# EAGLE design alswitch (EAGLE 7.5.0)
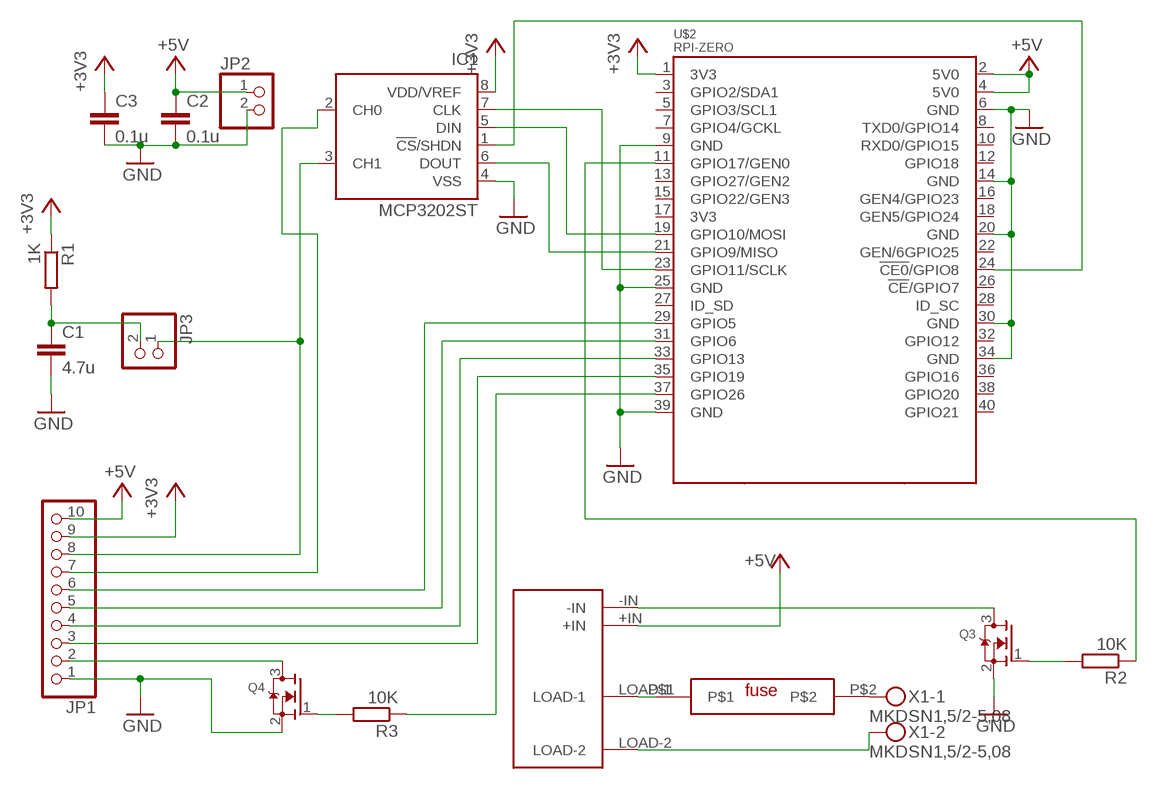
[diagram p0: schematic, sheet 1]

## Parts
C1  4.7u  C-EUC1206  [C1206]
C2  0.1u  C-EUC1206  [C1206]
C3  0.1u  C-EUC1206  [C1206]
IC1  MCP3202ST  [TSSOP8]
JP1  PINHD-1X10  [1X10]
JP2  PINHD-1X2  [1X02]
JP3  PINHD-1X2  [1X02]
Q3  MOSFET-NREFLOW  [SOT23]
Q4  MOSFET-NREFLOW  [SOT23]
R1  1K  R-EU_R0805  [R0805]
R2  10K  R-EU_R0805  [R0805]
R3  10K  R-EU_R0805  [R0805]
U$1  FUSE  [FUSE]
U$2  RPI-ZERO  [RASPBERRYPI_BASTELSTUBE_V13_RASPI_BOARD_B+_FULL]
U$3  G3MC-201PL  [G3MC-201PL]
X1  MKDSN1,5/2-5,08  [MKDSN1,5/2-5,08]

## Nets
+3V3: C3.1 IC1.8(VDD/VREF) JP1.9 R1.1 U$2.1(3V3)
+5V: C2.1 JP1.10 JP2.1 U$2.2(5V0) U$2.4(5V0) U$3.+IN
GND: C1.2 C2.2 C3.2 IC1.4(VSS) JP1.1 JP2.2 Q3.2(S) Q4.2(S) U$2.6(GND) U$2.9(GND) U$2.14(GND) U$2.20(GND) U$2.25(GND) U$2.30(GND) U$2.34(GND) U$2.39(GND)
N$1: IC1.7(CLK) U$2.23(GPIO11/SCLK)
N$2: Q3.3(D) U$3.-IN
N$3: R2.1 U$2.11(GPIO17/GEN0)
N$4: U$1.P$2 X1.1
N$5: IC1.5(DIN) U$2.19(GPIO10/MOSI)
N$6: IC1.6(DOUT) U$2.21(GPIO9/MISO)
N$7: Q3.1(G) R2.2
N$8: JP1.6 U$2.29(GPIO5)
N$9: Q4.1(G) R3.2
N$10: JP1.3 U$2.35(GPIO19)
N$11: U$1.P$1 U$3.LOAD-1
N$12: JP1.4 U$2.33(GPIO13)
N$13: JP1.5 U$2.31(GPIO6)
N$14: IC1.1(!CS!/SHDN) U$2.24(!CE0!/GPIO8)
N$15: IC1.3(CH1) JP1.8 JP3.1
N$16: IC1.2(CH0) JP1.7
N$17: C1.1 JP3.2 R1.2
N$18: JP1.2 Q4.3(D)
N$19: R3.1 U$2.37(GPIO26)
N$20: U$3.LOAD-2 X1.2
Unconnected: U$2.3(GPIO2/SDA1) U$2.5(GPIO3/SCL1) U$2.7(GPIO4/GCKL) U$2.8(TXD0/GPIO14) U$2.10(RXD0/GPIO15) U$2.12(GPIO18) U$2.13(GPIO27/GEN2) U$2.15(GPIO22/GEN3) U$2.16(GEN4/GPIO23) U$2.17(3V3) U$2.18(GEN5/GPIO24) U$2.22(GEN/6GPIO25) U$2.26(!CE!/GPIO7) U$2.27(ID_SD) U$2.28(ID_SC) U$2.32(GPIO12) U$2.36(GPIO16) U$2.38(GPIO20) U$2.40(GPIO21)

## Library data of the parts
C1-C3 = rcl:C-EU: CAPACITOR, European symbol
IC1 = microchip:MCP3202: 2.7V Dual Channel 12-Bit A/D Converter with SPI Serial Interface Source: http://ww1.microchip.com/downloads/en/DeviceDoc/21034D.pdf; MF: MICROCHIP; MPN: MCP3202-CI/ST; OC_FARNELL: unknown; OC_NEWARK: 59K0226
JP1 = pinhead:PINHD-1X10: PIN HEADER
JP2 JP3 = pinhead:PINHD-1X2: PIN HEADER
Q3 Q4 = adafruit:MOSFET-N: N-Channel Mosfet 2N7002E - 60V 260mA SOT23 [Digikey: 2N7002ET1GOSTR-ND] - REEL BSH103 - 30V 850mA SOT23 [Digikey: 568-5013-1-ND]
R1-R3 = rcl:R-EU_: RESISTOR, European symbol
U$1 = alexa:FUSE
U$2 = RPI-Zero:RPI-ZERO
U$3 = alexa:G3MC-201PL
X1 = con-phoenix-508:MKDSN1,5/2-5,08: MKDSN 1,5/ 2-5,08 Printklemme Nennstrom: 13,5 A Nennspannung: 250 V Rastermaß: 5,08 mm Polzahl: 2 Anschlussart: Schraubanschluss Montage: Löten Anschlussrichtung Leiter/Platine: 0 ° Artikelnummer: 1729128 Source: http://eshop.phoenixcontact.com .. 1729128.pdf

## Net classes
1 power: width 0.61 mm, drill 0.711 mm, clearance 0.203 mm
2 gnd: width 0.305 mm, drill 0.711 mm, clearance 0.203 mm
3 usbvcc: width 0.508 mm, drill 0.711 mm, clearance 0.203 mm

## Board
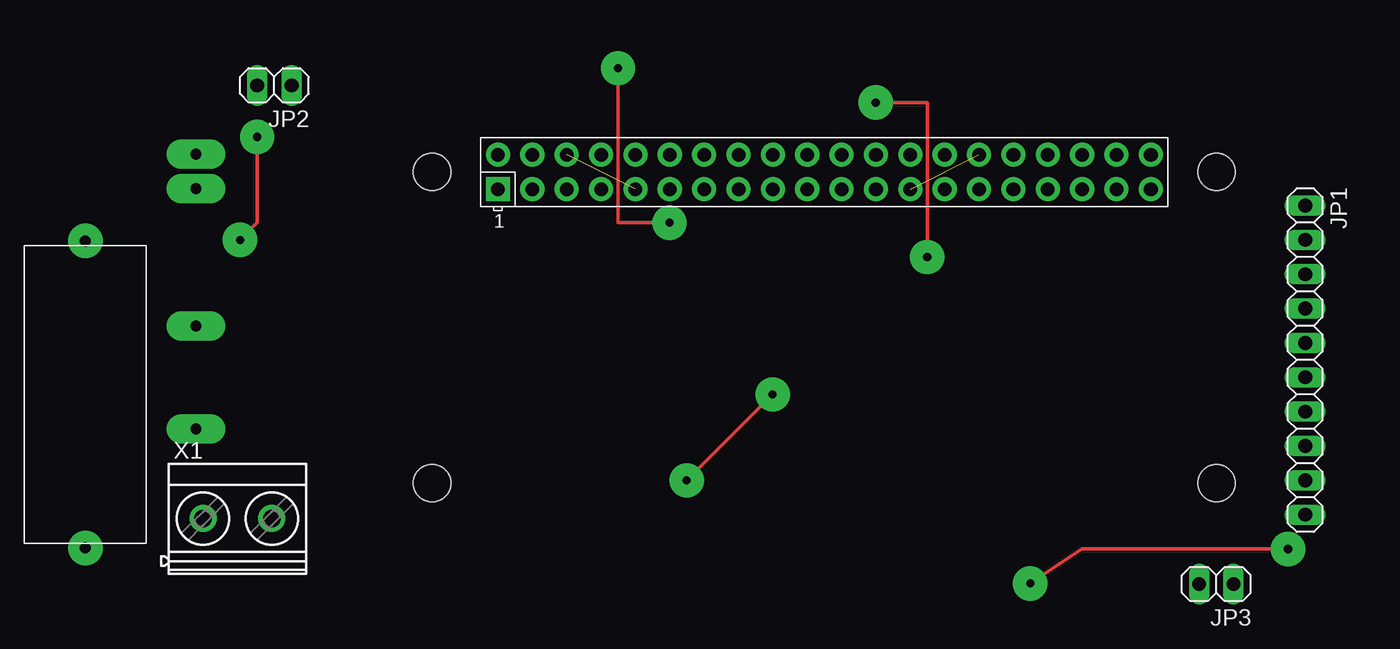
[diagram p1: board, top side]
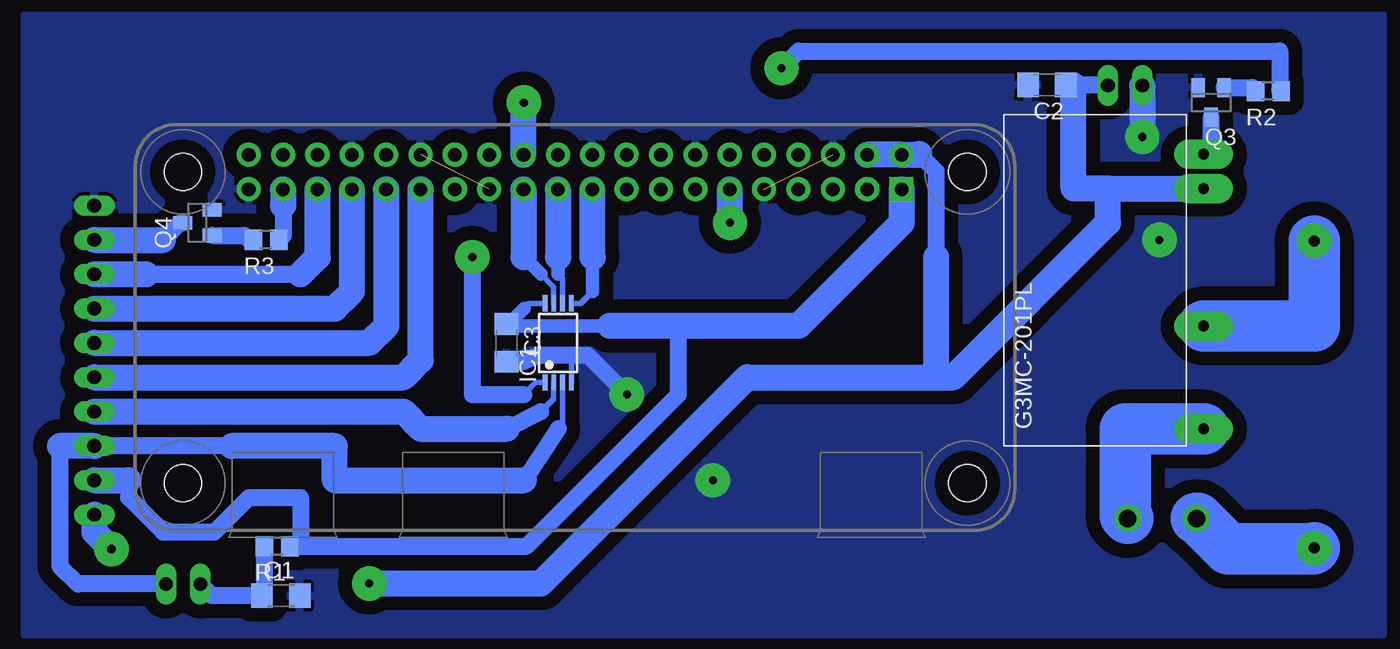
[diagram p2: board, bottom side, seen from below]

No outline drawn. Coordinates in mm, seen from the top.
Copper layers (1*16): Top 0.035mm / dielectric 1.5mm / Bottom 0.035mm
Design rules "default *": minimum track width 8mil, minimum drill 16mil, track to track 12mil, track to pad 12mil, pad to pad 12mil, via to via 12mil, smd to smd 8mil, copper to edge 40mil, drill to drill 12mil, minimum pad ring 10mil, minimum via ring 10mil, stop-mask expansion 4mil, vias tented up to drill 0mil, thermal gap 10mil

### Footprints (pad centres in the part's own frame; a part is rotated, then mirrored left to right if it is on the bottom)
C1206 = smd 1.6 x 1.8: 1 -1.4,0; 2 1.4,0
TSSOP8 = smd 0.35 x 1.2: 1 -0.975,-2.925; 2 -0.325,-2.925; 3 0.325,-2.925; 4 0.975,-2.925; 5 0.975,2.925; 6 0.325,2.925; 7 -0.325,2.925; 8 -0.975,2.925
1X10 = drill 1.016 long: 1 -11.43,0; 2 -8.89,0; 3 -6.35,0; 4 -3.81,0; 5 -1.27,0; 6 1.27,0; 7 3.81,0; 8 6.35,0; 9 8.89,0; 10 11.43,0
1X02 = drill 1.016 long: 1 -1.27,0; 2 1.27,0
SOT23 = smd 1 x 1.4: 1 -0.95,-1.1; 2 0.95,-1.1; 3 0,1.1
R0805 = smd 1.3 x 1.5: 1 -0.95,0; 2 0.95,0
FUSE = drill 0.8 pad 2.54: P$1 11.35,0; P$2 -11.35,0
RASPBERRYPI_BASTELSTUBE_V13_RASPI_BOARD_B+_FULL = drill 1 pad 1.778 square: 1 8.37,25.23 | drill 1 pad 1.778: 2 8.37,27.77; 3 10.91,25.23; 4 10.91,27.77; 5 13.45,25.23; 6 13.45,27.77; 7 15.99,25.23; 8 15.99,27.77; 9 18.53,25.23; 10 18.53,27.77; 11 21.07,25.23; 12 21.07,27.77; 13 23.61,25.23; 14 23.61,27.77; 15 26.15,25.23; 16 26.15,27.77; 17 28.69,25.23; 18 28.69,27.77; 19 31.23,25.23; 20 31.23,27.77; 21 33.77,25.23; 22 33.77,27.77; 23 36.31,25.23; 24 36.31,27.77; 25 38.85,25.23; 26 38.85,27.77; 27 41.39,25.23; 28 41.39,27.77; 29 43.93,25.23; 30 43.93,27.77; 31 46.47,25.23; 32 46.47,27.77; 33 49.01,25.23; 34 49.01,27.77; 35 51.55,25.23; 36 51.55,27.77; 37 54.09,25.23; 38 54.09,27.77; 39 56.63,25.23; 40 56.63,27.77 | hole 2.75: 3.5,3.5; 3.5,26.5; 61.5,3.5; 61.5,26.5
G3MC-201PL = drill 0.8 pad 2.184 long: +IN 19.05,-1.27; -IN 21.59,-1.27; LOAD-1 8.89,-1.27; LOAD-2 1.27,-1.27
MKDSN1,5/2-5,08 = drill 1.3 pad 2: 1 -2.561,0.025; 2 2.519,0.025

### Placement (x,y rotation side)
C1  84,4.17 0 bottom
C2  27.37,41.93 180 bottom
C3  67.31,22.86 270 bottom
IC1  63.5,22.86 0 bottom
JP1  97.79,21.59 270 top
JP2  21.59,41.91 180 top
JP3  91.22,5.03 180 top
Q3  15.24,40.64 180 bottom
Q4  90.17,31.75 90 bottom
R1  84.28,7.82 180 bottom
R2  11.01,41.48 180 bottom
R3  85.09,30.48 180 bottom
U$1  7.62,19.05 90 top
U$2  29.75,9 0 top
U$3  17.06,15.23 90 bottom
X1  18.88,9.85 0 top

### Tracks (layer width: path | path; a pad name or v marks a point on that pad's centre or on a via)
+3V3
  Bottom 0.406: IC1.8 65.66,25.79 66.04,25.4
  Bottom 1.016: 66.04,25.4 67.18,24.26 C3.1 67.18,24.13 59.69,24.13
  Bottom 1.27: R1.1 82.55,7.82 | 82.55,7.82 65.84,7.82 54.61,19.05 54.61,24.13 | 95.25,12.7 95.25,11.43 92.71,8.89 88.9,8.89 86.36,11.43 82.55,11.43 82.55,7.82
  Bottom 1.93: 59.69,24.13 54.61,24.13 45.72,24.13 38.1,31.75 38.1,33.02 38.12,33.04 U$2.1 | JP1.9 95.25,12.7
+5V  (via drill 0.6 pad 2.54)
  Top 0.254: v96.52,7.62 81.28,7.62 v77.47,5.08
  Bottom 1.27: JP2.1 25.4,41.91 25.95,41.91 C2.1 | 36.83,36.83 35.56,35.56 35.56,29.21
  Bottom 1.93: U$2.4 U$2.2 36.89,36.77 36.83,36.83 | 22.86,34.29 U$3.+IN | JP1.10 97.79,8.89 v96.52,7.62 | 22.86,34.29 22.86,31.75 34.29,20.32 35.56,20.32 | v77.47,5.08 64.77,5.08 49.53,20.32 35.56,20.32 | 35.56,29.21 35.56,20.32 | 22.86,34.29 25.4,34.29 25.4,41.91
GND  (via drill 0.6 pad 2.54)  (2 unrouted)
  Top 0.254: v58.42,19.05 v52.07,12.7 | v20.32,38.1 20.32,31.75 v19.05,30.48
  Bottom 0.406: IC1.4 62.52,21.96 62.23,22.26
  Bottom 1.27: C3.2 66.17,21.46 64.97,21.96 63.02,21.96 | 63.02,21.96 62.52,21.96 | 63.02,21.96 61.33,21.96 v58.42,19.05
  Bottom 1.93: JP2.2 v20.32,38.1
  pour Bottom (isolate 1.016): 2.54,47.11 2.54,1.27 102.94,1.27 102.94,47.11
N$1
  Bottom 0.406: IC1.7 63.83,27 64.77,27.94
  Bottom 1.016: 66.04,29.21 64.77,27.94
  Bottom 1.93: U$2.23 66.06,29.23 66.04,29.21
N$2
  Bottom 1.27: Q3.3 15.24,37.37 U$3.-IN
N$3  (via drill 0.6 pad 2.54)
  Top 0.254: v50.8,31.75 46.99,31.75 v46.99,43.18
  Bottom 1.27: v46.99,43.18 45.72,44.45 10.16,44.45 10.16,41.58 R2.1
  Bottom 1.93: U$2.11 50.82,31.77 v50.8,31.75
N$4
  Bottom 3.81: X1.1 16.23,9.88 13.97,7.62 7.7,7.62 U$1.P$2
N$5
  Bottom 0.406: IC1.5 61.84,25.79 60.96,26.67
  Bottom 1.016: 60.96,29.21 60.96,26.67
  Bottom 1.93: U$2.19 60.98,29.23 60.96,29.21
N$6
  Bottom 0.406: IC1.6 63.17,27.61 63.5,27.94
  Bottom 1.016: 63.5,29.21 63.5,27.94
  Bottom 1.93: U$2.21 63.52,29.23 63.5,29.21
N$7
  Bottom 1.27: Q3.1 12.22,41.74 R2.2
N$8
  Bottom 1.93: JP1.6 74.93,20.32 73.66,21.59 73.66,34.21 U$2.29
N$9
  Bottom 1.27: Q4.1 86.68,30.8 86.36,30.48 R3.2
N$10
  Bottom 1.27: 93.98,27.94 82.55,27.94
  Bottom 1.93: 82.55,27.94 81.28,29.21 81.28,34.21 U$2.35 | JP1.3 93.98,27.94
N$11
  Bottom 3.81: U$1.P$1 7.62,24.13 U$3.LOAD-1
N$12
  Bottom 1.93: JP1.4 80.01,25.4 78.74,26.67 78.74,34.21 U$2.33
N$13
  Bottom 1.93: JP1.5 77.47,22.86 76.2,24.13 76.2,34.21 U$2.31
N$14  (via drill 0.6 pad 2.54)
  Top 0.254: v66.04,40.64 69.85,40.64 v69.85,29.21
  Bottom 0.406: IC1.1 65.16,19.93 66.04,19.05
  Bottom 1.27: v69.85,29.21 69.85,19.05 66.04,19.05
  Bottom 1.93: U$2.24 66.06,40.62 v66.04,40.64
N$15
  Bottom 0.406: IC1.3 63.17,16.84 63.5,16.51
  Bottom 1.27: 63.5,16.51 66.04,12.7 | 100.33,15.24 100.33,6.35 99.01,5.03 JP3.1 | 87.63,15.24 JP1.8
  Bottom 1.93: JP1.8 100.33,15.24 | 66.04,12.7 80.01,12.7 80.01,15.24 87.63,15.24
N$16
  Bottom 0.406: IC1.2 63.83,18.73 64.77,17.78
  Bottom 1.27: 67.31,16.51 64.77,17.78
  Bottom 1.93: JP1.7 74.93,17.78 73.66,16.51 67.31,16.51
N$17
  Bottom 1.27: R1.2 85.23,4.34 C1.1 89.09,4.17 JP3.2
N$18
  Bottom 1.27: Q4.3 91.44,31.75 92.71,30.48
  Bottom 1.93: JP1.2 92.71,30.48
N$19
  Bottom 1.27: 83.82,33.02 83.82,30.8 R3.1
  Bottom 1.93: U$2.37 83.84,33.04 83.82,33.02
N$20
  Bottom 3.81: U$3.LOAD-2 21.58,16.5 21.59,16.51 21.59,10.07 X1.2